# Altium schematic sheet bidirectional_audio_v4.0_Digital.SchDoc
size A
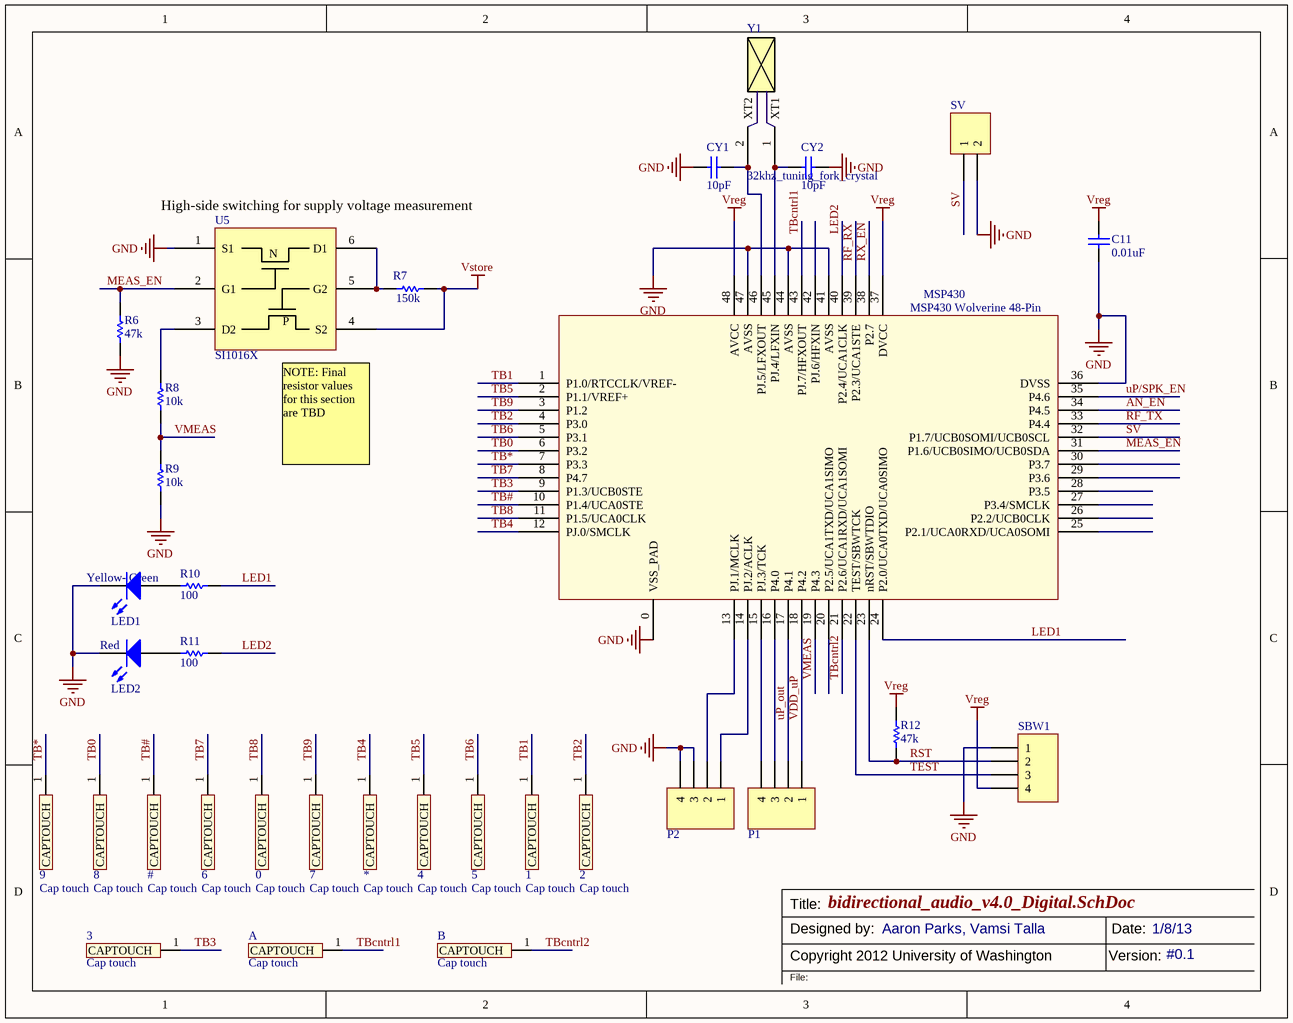
[diagram p0: bidirectional_audio_v4.0_Digital.SchDoc]

## Parts
0  Cap touch  [CAPTOUCH-8mm]
1  Cap touch  [CAPTOUCH-8mm]
2  Cap touch  [CAPTOUCH-8mm]
3  Cap touch  [CAPTOUCH-8mm]
4  Cap touch  [CAPTOUCH-8mm]
5  Cap touch  [CAPTOUCH-8mm]
6  Cap touch  [CAPTOUCH-8mm]
7  Cap touch  [CAPTOUCH-8mm]
8  Cap touch  [CAPTOUCH-8mm]
9  Cap touch  [CAPTOUCH-8mm]
#  Cap touch  [CAPTOUCH-8mm]
*  Cap touch  [CAPTOUCH-8mm]
A  Cap touch  [CAPTOUCH-8mm]
B  Cap touch  [CAPTOUCH-8mm]
C11  value 0.01uF  [0402]  (hidden comment: Cdecap_MSP)
CY1  value 10pF  [0402]  (hidden comment: C_crystal)
CY2  value 10pF  [0402]  (hidden comment: C_crystal)
LED1  Note: Yellow- Green  [Diode - 0402]  (hidden comment: LED)
LED2  Note: Red  [Diode - 0402]  (hidden comment: LED)
MSP430  MSP430 Wolverine 48-Pin  [MSP_QFN48_RGZ_PAD0]
P1  MHDR1X4  [MHDR1X4]  (value not drawn)
P2  MHDR1X4  [MHDR1X4]  (value not drawn)
R6  value 47k  [0402]  (hidden comment: Res_HSS)
R7  value 150k  [0402]  (hidden comment: Res_HSS)
R8  value 10k  [0402]  (hidden comment: Res_HSS)
R9  value 10k  [0402]  (hidden comment: Res_HSS)
R10  value 100  [0402]  (hidden comment: Res_LED)
R11  value 100  [0402]  (hidden comment: Res_LED)
R12  value 47k  [0402]  (hidden comment: Res_HSS)
SBW1  MHDR1X4-angled  [MHDR1X4]  (value not drawn)
SV  MHDR1X2  [MHDR1X2]  (value not drawn)
U5  SI1016X  [SC-89-6 Vishay]
Y1  32khz_tuning_fork_crystal  [Crystal_tuning_fork_32khz]

## Nets
GND: C11.1 CY1.1 CY2.2 LED1.2(K) LED2.2(K) MSP430.0(VSS_PAD) MSP430.36(DVSS) MSP430.41(AVSS) MSP430.44(AVSS) MSP430.47(AVSS) P2.3 P2.4 R6.1 R9.1 SBW1.1 SV.2 U5.1(S1)
Vreg: C11.2 MSP430.37(DVCC) MSP430.48(AVCC) R12.2 SBW1.4
Vstore: R7.1 U5.4(S2)
AN_EN: MSP430.34(P4.5)
LED1: MSP430.24(P2.0/UCA0TXD/UCA0SIMO) R10.1
LED2: MSP430.40(P2.4/UCA1CLK) R11.1
MEAS_EN: MSP430.31(P1.6/UCB0SIMO/UCB0SDA) R6.2 U5.2(G1)
RF_RX: MSP430.39(P2.3/UCA1STE)
RF_TX: MSP430.33(P4.4)
RST: MSP430.23(nRST/SBWTDIO) R12.1 SBW1.2
RX_EN: MSP430.38(P2.7)
SV: MSP430.32(P1.7/UCB0SOMI/UCB0SCL) SV.1
TB0: 8.1(CAPTOUCH) MSP430.6(P3.2)
TB1: 1.1(CAPTOUCH) MSP430.1(P1.0/RTCCLK/VREF-)
TB2: 2.1(CAPTOUCH) MSP430.4(P3.0)
TB3: 3.1(CAPTOUCH) MSP430.9(P1.3/UCB0STE)
TB4: *.1(CAPTOUCH) MSP430.12(PJ.0/SMCLK)
TB5: 4.1(CAPTOUCH) MSP430.2(P1.1/VREF+)
TB6: 5.1(CAPTOUCH) MSP430.5(P3.1)
TB7: 6.1(CAPTOUCH) MSP430.8(P4.7)
TB8: 0.1(CAPTOUCH) MSP430.11(P1.5/UCA0CLK)
TB9: 7.1(CAPTOUCH) MSP430.3(P1.2)
TB#: #.1(CAPTOUCH) MSP430.10(P1.4/UCA0STE)
TB*: 9.1(CAPTOUCH) MSP430.7(P3.3)
TBcntrl1: A.1(CAPTOUCH) MSP430.43(PJ.7/HFXOUT)
TBcntrl2: B.1(CAPTOUCH) MSP430.21(P2.6/UCA1RXD/UCA1SOMI)
TEST: MSP430.22(TEST/SBWTCK) SBW1.3
uP/SPK_EN: MSP430.35(P4.6)
uP_out: MSP430.17(P4.1) P1.2
VDD_uP: MSP430.18(P4.2) P1.1
VMEAS: MSP430.19(P4.3) R8.1 R9.2
NetCY1_2: CY1.2 MSP430.46(PJ.5/LFXOUT) Y1.2(XT2)
NetCY2_1: CY2.1 MSP430.45(PJ.4/LFXIN) Y1.1(XT1)
NetLED1_1: LED1.1(A) R10.2
NetLED2_1: LED2.1(A) R11.2
NetMSP430_13: MSP430.13(PJ.1/MCLK) P2.2
NetMSP430_14: MSP430.14(PJ.2/ACLK) P2.1
NetMSP430_15: MSP430.15(PJ.3/TCK) P1.4
NetMSP430_16: MSP430.16(P4.0) P1.3
NetR7_2: R7.2 U5.5(G2) U5.6(D1)
NetR8_2: R8.2 U5.3(D2)

Not connected (* = marked no-connect by the designer): MSP430 20(P2.5/UCA1TXD/UCA1SIMO) 25(P2.1/UCA0RXD/UCA0SOMI) 26(P2.2/UCB0CLK) 27(P3.4/SMCLK) 28(P3.5) 29(P3.6) 30(P3.7) 42(PJ.6/HFXIN)

## Notes on the sheet
- (near U5) High-side switching for supply voltage measurement
- (near U5) NOTE: Final resistor values for this section are TBD
- Title:
- Copyright 2012 University of Washington
- Designed by:
- Aaron Parks, Vamsi Talla
- Version:
- Date:
- 1/8/13
- #0.1
- File:
- (in symbol SI1016X) N; P

## Library data of the parts
0-9 # * A B = Cap touch: Cap Touch Buttons; Value: DNP
C11 = Cap: Ceramic Capacitor (Surface Mount); Manufacturer: Samsung Electro-Mechanics America, Inc.; Manufacturer Part Number: CL05B103JB5NNNC; Note: CAP CER 10000PF 50V X7R 0402; Digi-Key Part Number: 1276-1495-1-ND; Rating: *
CY1 CY2 = Cap: Ceramic Capacitor (Surface Mount); Manufacturer: Johanson Technology Inc.; Manufacturer Part Number: 500R07S100GV4T; Note: CAP CER 10PF 50V NP0 0402; Rating: 50 V; Digi-Key Part Number: 712-1252-1-ND
LED1 = Diode - picoLED: Green LED; Manufacturer: Rohm Semiconductor; Manufacturer Part Number: SML-P11MTT86; Digi-Key Part Number: *; Value: *; Rating: *
LED2 = Diode - picoLED: RED LED; Manufacturer: Rohm Semiconductor; Manufacturer Part Number: SML-P11UTT86; Digi-Key Part Number: *; Value: *; Rating: *
MSP430 = MSP430FR596X_586X_RGZ: 16-bit FRAM MCU; Manufacturer: Texas Instruments; Manufacturer Part Number: MSP430FR5969IRGZR; Note: IC MCU 16BIT 64KB FRAM 48VQFN; Digi-Key Part Number: 296-37875-1-ND; Datasheet Link: http://www.ti.com/lit/gpn/msp430fr5969
P1 P2 = MHDR1X4: Header, 4-Pin; Manufacturer Part Number: 851-43-004-10-001000; Manufacturer: Mill-Max Manufacturing Corp.; Note: Connector Receptacle 4 Position 0.050" (1.27mm) Gold Through Hole; LatestRevisionDate: 17-Jul-2002; LatestRevisionNote: Re-released for DXP Platform.; Publisher: Altium Limited; Digi-Key Part Number: ED90528-ND
R6 R12 = Res: Chip Resistor (Surface Mount); Manufacturer: Vishay Dale; Manufacturer Part Number: CRCW040247K0FKED; Note: RES SMD 47K OHM 1% 1/16W 0402; Digi-Key Part Number: 541-47.0KLCT-ND; Rating: *
R7 = Res: Chip Resistor (Surface Mount); Manufacturer: Vishay Dale; Manufacturer Part Number: CRCW0402150KFKED; Note: RES SMD 150K OHM 1% 1/16W 0402; Digi-Key Part Number: 541-150KLCT-ND; Rating: *
R8 R9 = Res: Chip Resistor (Surface Mount); Manufacturer: Vishay Dale; Manufacturer Part Number: CRCW040210K0FKED; Note: RES SMD 10K OHM 1% 1/16W 0402; Digi-Key Part Number: 541-10.0KLCT-ND; Rating: *
R10 R11 = Res: Chip Resistor (Surface Mount); Manufacturer: Vishay Dale; Manufacturer Part Number: CRCW0402100RFKED; Rating: 1/16W; Digi-Key Part Number: 541-100LCT-ND
SBW1 = MHDR1X4: Header, 4-Pin; Manufacturer: Mill-Max Manufacturing Corp.; Manufacturer Part Number: 851-43-004-20-001000; Note: Connector Receptacle 4 Position 0.050" (1.27mm) Gold Through Hole, Right Angle; LatestRevisionDate: 17-Jul-2002; LatestRevisionNote: Re-released for DXP Platform.; Publisher: Altium Limited; Digi-Key Part Number: ED90474-ND
SV = MHDR1X2: Header, 2-Pin; Manufacturer: FCI; Manufacturer Part Number: 77311-118-02LF; Note: CONN HEADER 2POS VERT T/H; LatestRevisionDate: 17-Jul-2002; LatestRevisionNote: Re-released for DXP Platform.; Publisher: Altium Limited; Digi-Key Part Number: 609-4434-ND
U5 = SI1016X: NMOS and PMOS array; Manufacturer: Vishay Siliconix; Manufacturer Part Number: SI1016X-T1-GE3; Note: MOSFET N/P-CH 20V SC89-6; Digi-Key Part Number: SI1016X-T1-GE3CT-ND
Y1 = 32khz_tuning_fork_crystal: 32 khz crystal; Manufacturer Part Number: MS3V-T1R; Manufacturer: MICRO CRYSTAL; Note: 32.768KHZ +-20PPM 12; Newark Part Number: 94M8466